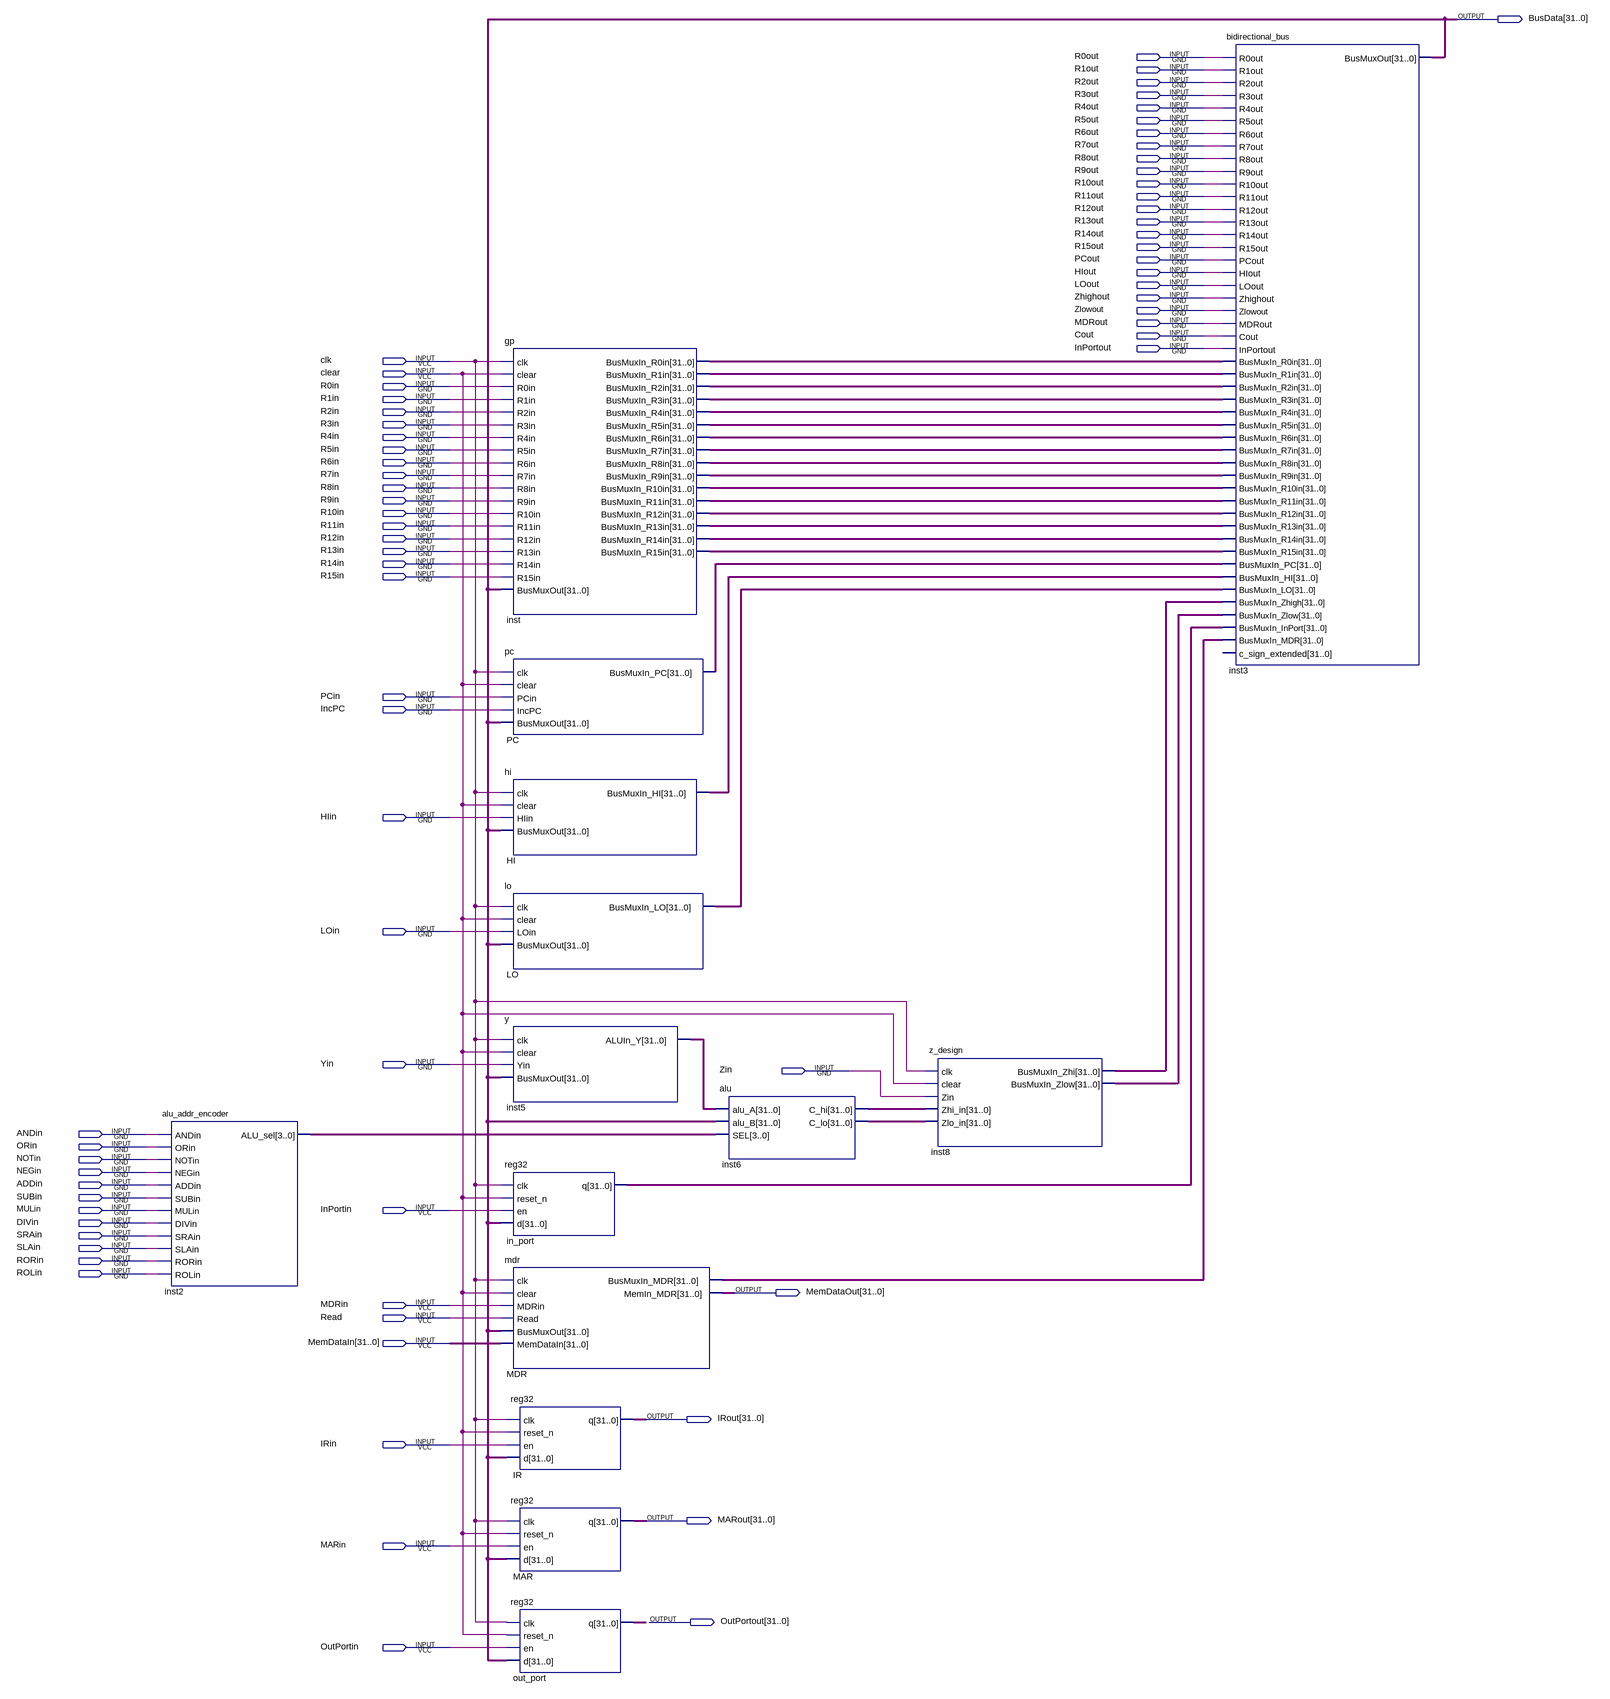
[diagram p0: schematic sheet]
// Quartus schematic datapath_design.bdf as structural Verilog: 14 symbols, 72 pins
module datapath_design (
  input  R0out,
  input  R1out,
  input  R2out,
  input  R3out,
  input  R4out,
  input  R5out,
  input  R6out,
  input  R7out,
  input  R8out,
  input  R9out,
  input  R10out,
  input  R11out,
  input  R12out,
  input  R13out,
  input  R14out,
  input  R15out,
  input  PCout,
  input  HIout,
  input  LOout,
  input  Zhighout,
  input  Zlowout,
  input  MDRout,
  input  Cout,
  input  InPortout,
  input  clk,
  input  clear,
  input  R0in,
  input  R1in,
  input  R2in,
  input  R3in,
  input  R4in,
  input  R5in,
  input  R6in,
  input  R7in,
  input  R8in,
  input  R9in,
  input  R10in,
  input  R11in,
  input  R12in,
  input  R13in,
  input  R14in,
  input  R15in,
  input  PCin,
  input  IncPC,
  input  HIin,
  input  LOin,
  input  Yin,
  input  Zin,
  input  ANDin,
  input  ORin,
  input  NOTin,
  input  NEGin,
  input  ADDin,
  input  SUBin,
  input  MULin,
  input  InPortin,
  input  DIVin,
  input  SRAin,
  input  SLAin,
  input  RORin,
  input  ROLin,
  input  MDRin,
  input  Read,
  input  [31:0] MemDataIn,
  input  IRin,
  input  MARin,
  input  OutPortin,
  output [31:0] BusData,
  output [31:0] MemDataOut,
  output [31:0] IRout,
  output [31:0] MARout,
  output [31:0] OutPortout
);

  wire [3:0] inst2_alu_sel;
  wire [31:0] HI_busmuxin_hi, in_port_q, inst5_aluin_y, inst6_c_hi, inst6_c_lo, inst8_busmuxin_zhi,
       inst8_busmuxin_zlow, inst_busmuxin_r0in, inst_busmuxin_r1in, inst_busmuxin_r2in, inst_busmuxin_r3in,
       inst_busmuxin_r4in, inst_busmuxin_r5in, inst_busmuxin_r6in, inst_busmuxin_r7in, inst_busmuxin_r8in,
       inst_busmuxin_r9in, inst_busmuxin_r10in, inst_busmuxin_r11in, inst_busmuxin_r12in,
       inst_busmuxin_r13in, inst_busmuxin_r14in, inst_busmuxin_r15in, LO_busmuxin_lo, MDR_busmuxin_mdr,
       PC_busmuxin_pc;

  alu_addr_encoder inst2 (
    .ANDin(ANDin), .ORin(ORin), .NOTin(NOTin), .NEGin(NEGin), .ADDin(ADDin), .SUBin(SUBin), .MULin(MULin),
    .DIVin(DIVin), .SRAin(SRAin), .SLAin(SLAin), .RORin(RORin), .ROLin(ROLin), .ALU_sel(inst2_alu_sel));
  gp inst (
    .clk(clk), .clear(clear), .R0in(R0in), .R1in(R1in), .R2in(R2in), .R3in(R3in), .R4in(R4in), .R5in(R5in),
    .R6in(R6in), .R7in(R7in), .R8in(R8in), .R9in(R9in), .R10in(R10in), .R11in(R11in), .R12in(R12in),
    .R13in(R13in), .R14in(R14in), .R15in(R15in), .BusMuxOut(BusData), .BusMuxIn_R0in(inst_busmuxin_r0in),
    .BusMuxIn_R1in(inst_busmuxin_r1in), .BusMuxIn_R2in(inst_busmuxin_r2in),
    .BusMuxIn_R3in(inst_busmuxin_r3in), .BusMuxIn_R4in(inst_busmuxin_r4in),
    .BusMuxIn_R5in(inst_busmuxin_r5in), .BusMuxIn_R6in(inst_busmuxin_r6in),
    .BusMuxIn_R7in(inst_busmuxin_r7in), .BusMuxIn_R8in(inst_busmuxin_r8in),
    .BusMuxIn_R9in(inst_busmuxin_r9in), .BusMuxIn_R10in(inst_busmuxin_r10in),
    .BusMuxIn_R11in(inst_busmuxin_r11in), .BusMuxIn_R12in(inst_busmuxin_r12in),
    .BusMuxIn_R13in(inst_busmuxin_r13in), .BusMuxIn_R14in(inst_busmuxin_r14in),
    .BusMuxIn_R15in(inst_busmuxin_r15in));
  pc PC (.clk(clk), .clear(clear), .PCin(PCin), .IncPC(IncPC), .BusMuxOut(BusData), .BusMuxIn_PC(PC_busmuxin_pc));
  hi HI (.clk(clk), .clear(clear), .HIin(HIin), .BusMuxOut(BusData), .BusMuxIn_HI(HI_busmuxin_hi));
  lo LO (.clk(clk), .clear(clear), .LOin(LOin), .BusMuxOut(BusData), .BusMuxIn_LO(LO_busmuxin_lo));
  y inst5 (.clk(clk), .clear(clear), .Yin(Yin), .BusMuxOut(BusData), .ALUIn_Y(inst5_aluin_y));
  reg32 in_port (.clk(clk), .reset_n(clear), .en(InPortin), .d(BusData), .q(in_port_q));
  mdr MDR (
    .clk(clk), .clear(clear), .MDRin(MDRin), .Read(Read), .BusMuxOut(BusData), .MemDataIn(MemDataIn),
    .BusMuxIn_MDR(MDR_busmuxin_mdr), .MemIn_MDR(MemDataOut));
  reg32 IR (.clk(clk), .reset_n(clear), .en(IRin), .d(BusData), .q(IRout));
  reg32 MAR (.clk(clk), .reset_n(clear), .en(MARin), .d(BusData), .q(MARout));
  reg32 out_port (.clk(clk), .reset_n(clear), .en(OutPortin), .d(BusData), .q(OutPortout));
  alu inst6 (.alu_A(inst5_aluin_y), .alu_B(BusData), .SEL(inst2_alu_sel), .C_hi(inst6_c_hi), .C_lo(inst6_c_lo));
  z_design inst8 (
    .clk(clk), .clear(clear), .Zin(Zin), .Zhi_in(inst6_c_hi), .Zlo_in(inst6_c_lo),
    .BusMuxIn_Zhi(inst8_busmuxin_zhi), .BusMuxIn_Zlow(inst8_busmuxin_zlow));
  bidirectional_bus inst3 (
    .R0out(R0out), .R1out(R1out), .R2out(R2out), .R3out(R3out), .R4out(R4out), .R5out(R5out), .R6out(R6out),
    .R7out(R7out), .R8out(R8out), .R9out(R9out), .R10out(R10out), .R11out(R11out), .R12out(R12out),
    .R13out(R13out), .R14out(R14out), .R15out(R15out), .PCout(PCout), .HIout(HIout), .LOout(LOout),
    .Zhighout(Zhighout), .Zlowout(Zlowout), .MDRout(MDRout), .Cout(Cout), .InPortout(InPortout),
    .BusMuxIn_R0in(inst_busmuxin_r0in), .BusMuxIn_R1in(inst_busmuxin_r1in),
    .BusMuxIn_R2in(inst_busmuxin_r2in), .BusMuxIn_R3in(inst_busmuxin_r3in),
    .BusMuxIn_R4in(inst_busmuxin_r4in), .BusMuxIn_R5in(inst_busmuxin_r5in),
    .BusMuxIn_R6in(inst_busmuxin_r6in), .BusMuxIn_R7in(inst_busmuxin_r7in),
    .BusMuxIn_R8in(inst_busmuxin_r8in), .BusMuxIn_R9in(inst_busmuxin_r9in),
    .BusMuxIn_R10in(inst_busmuxin_r10in), .BusMuxIn_R11in(inst_busmuxin_r11in),
    .BusMuxIn_R12in(inst_busmuxin_r12in), .BusMuxIn_R13in(inst_busmuxin_r13in),
    .BusMuxIn_R14in(inst_busmuxin_r14in), .BusMuxIn_R15in(inst_busmuxin_r15in), .BusMuxIn_PC(PC_busmuxin_pc),
    .BusMuxIn_HI(HI_busmuxin_hi), .BusMuxIn_LO(LO_busmuxin_lo), .BusMuxIn_Zhigh(inst8_busmuxin_zhi),
    .BusMuxIn_Zlow(inst8_busmuxin_zlow), .BusMuxIn_InPort(in_port_q), .BusMuxIn_MDR(MDR_busmuxin_mdr),
    .BusMuxOut(BusData));  // open: c_sign_extended
endmodule
